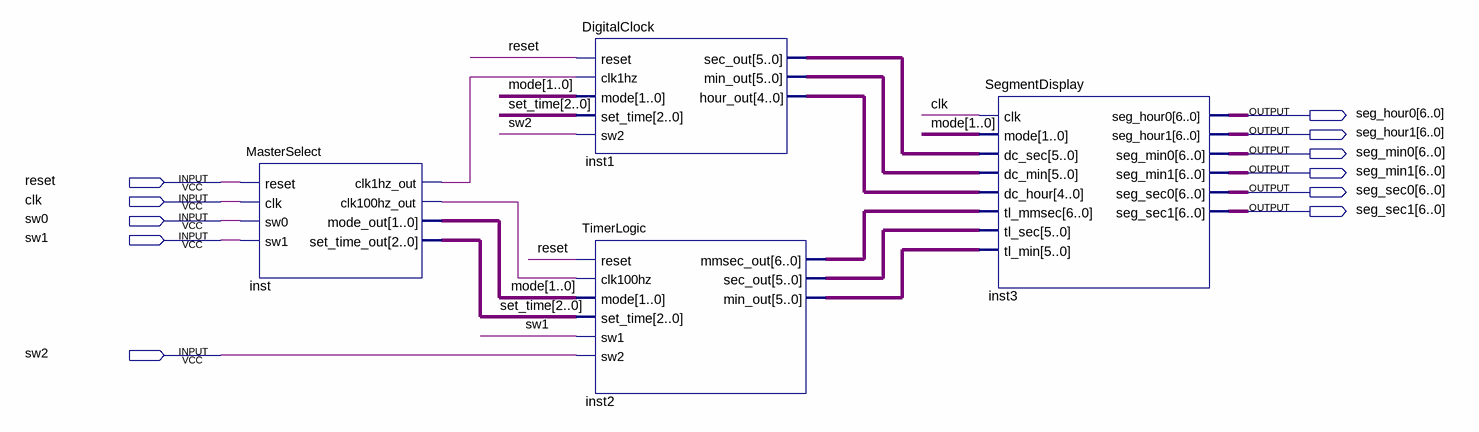
[diagram p0: schematic sheet]
// Quartus schematic DigitalWatch.bdf as structural Verilog: 4 symbols, 11 pins
module DigitalWatch (
  input  reset,
  input  clk,
  input  sw0,
  input  sw1,
  input  sw2,
  output [6:0] seg_hour0,
  output [6:0] seg_hour1,
  output [6:0] seg_min0,
  output [6:0] seg_min1,
  output [6:0] seg_sec0,
  output [6:0] seg_sec1
);

  wire inst_clk1hz_out, inst_clk100hz_out;
  wire [1:0] mode;
  wire [2:0] set_time;
  wire [4:0] inst1_hour_out;
  wire [5:0] inst1_min_out, inst1_sec_out, inst2_min_out, inst2_sec_out;
  wire [6:0] inst2_mmsec_out;

  MasterSelect inst (
    .reset(reset), .clk(clk), .sw0(sw0), .sw1(sw1), .clk1hz_out(inst_clk1hz_out),
    .clk100hz_out(inst_clk100hz_out), .mode_out(mode), .set_time_out(set_time));
  DigitalClock inst1 (
    .reset(reset), .clk1hz(inst_clk1hz_out), .mode(mode), .set_time(set_time), .sw2(sw2),
    .sec_out(inst1_sec_out), .min_out(inst1_min_out), .hour_out(inst1_hour_out));
  TimerLogic inst2 (
    .reset(reset), .clk100hz(inst_clk100hz_out), .mode(mode), .set_time(set_time), .sw1(sw1), .sw2(sw2),
    .mmsec_out(inst2_mmsec_out), .sec_out(inst2_sec_out), .min_out(inst2_min_out));
  SegmentDisplay inst3 (
    .clk(clk), .mode(mode), .dc_sec(inst1_sec_out), .dc_min(inst1_min_out), .dc_hour(inst1_hour_out),
    .tl_mmsec(inst2_mmsec_out), .tl_sec(inst2_sec_out), .tl_min(inst2_min_out), .seg_hour0(seg_hour0),
    .seg_hour1(seg_hour1), .seg_min0(seg_min0), .seg_min1(seg_min1), .seg_sec0(seg_sec0), .seg_sec1(seg_sec1));
endmodule
